# Altium project Bai 2.PrjPcb
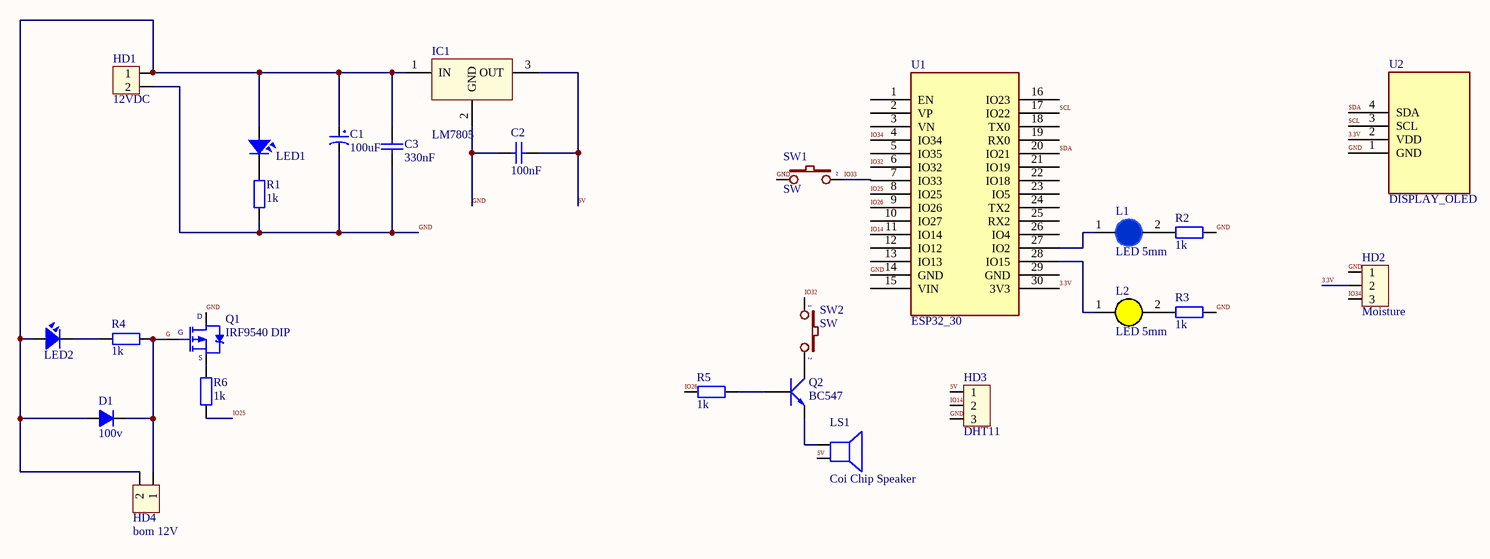
[diagram p0: Sheet1.SchDoc]
1 sheet, 26 parts. Net scope: global (net labels, ports and power ports of the same name join across sheets).
Board file: PCB1.PcbDoc

## Sheet Sheet1.SchDoc
size A2; SheetNumber: 1; SheetTotal: 1

### Parts
C1  100uF  [tu hoa 6.5mm]
C2  100nF  [tu tantalum dip5.08]
C3  330nF  [Tu tantalum dip5.08]
D1  100v  [DIODE 1A]
HD1  12VDC  [HED2]
HD2  Moisture  [HED3]
HD3  DHT11  [HED3]
HD4  bom 12V  [HED2]
IC1  LM7805  [QTO-220]
L1  LED 5mm  [LED-5MM-BLUE]
L2  LED 5mm  [LED-5MM-Yellow]
LED1  LED  [LED-3]  (value not drawn)
LED2  LED  [LED-3]  (value not drawn)
LS1  Coi Chip Speaker  [Coi Chip Speacker]
Q1  IRF9540 DIP  [TO220]
Q2  BC547  [TO92]
R1  1k  [tro vach 1w]
R2  1k  [tro vach 1w]
R3  1k  [tro vach 1w]
R4  1k  [tro vach 1w]
R5  1k  [tro vach 1w]
R6  1k  [tro vach 1w]
SW1  SW  [SW2]
SW2  SW  [SW2]
U1  ESP32_30  [ESP32_30]
U2  DISPLAY_OLED  [DISPLAY_OLED]

### Nets
3.3V: HD2.2 U1.30(3V3) U2.2(VDD)
5V: C2.1 HD3.1 IC1.3(OUT) LS1.2
G: D1.2(K) HD4.1 Q1.1(G) R4.1
GND: C1.2 C2.2 C3.2 HD1.2 HD2.1 HD3.3 IC1.2(GND) Q1.2(D) R1.1 R2.2 R3.2 SW1.1 U1.14(GND) U2.1(GND)
IO14: HD3.2 U1.11(IO14)
IO25: R6.1 U1.8(IO25)
IO26: R5.1 U1.9(IO26)
IO32: SW2.1 U1.6(IO32)
IO33: SW1.2 U1.7(IO33)
IO34: HD2.3 U1.4(IO34)
SCL: U1.17(IO22) U2.3(SCL)
SDA: U1.20(IO21) U2.4(SDA)
NetC1_1: C1.1 C3.1 D1.1(A) HD1.1 HD4.2 IC1.1(IN) LED1.1 LED2.1
NetL1_1: L1.1(A) U1.27(IO2)
NetL1_2: L1.2(K) R2.1
NetL2_1: L2.1(A) U1.28(IO15)
NetL2_2: L2.2(K) R3.1
NetLED1_2: LED1.2 R1.2
NetLED2_2: LED2.2 R4.2
NetLS1_1: LS1.1 Q2.1(E)
NetQ1_3: Q1.3(S) R6.2
NetQ2_2: Q2.2(C) SW2.2
NetQ2_3: Q2.3(B) R5.2

Not connected (* = marked no-connect by the designer): U1 1(EN) 2(VP) 3(VN) 5(IO35) 10(IO27) 12(IO12) 13(IO13) 15(VIN) 16(IO23) 18(TX0) 19(RX0) 21(IO19) 22(IO18) 23(IO5) 24(TX2) 25(RX2) 26(IO4) 29(GND)

### Library data of the parts
C1 = Tu Hoa 100uF 35V 6x8: Cắm; Don_Vi: Con; So_Chan: 2; Ten_Linh_Kien: Tụ Hóa 100uF 35V; Ma_Hang: MH006862; Chung_Loai: Cắm; Kieu_Chan: *
C2 = Tu tantalum 100nF 50V 20% DIP5.08: Cắm; Don_Vi: Con; So_Chan: 2; Ten_Linh_Kien: Tụ tantalum 104-100nF 50V 20% DIP5.08 (sứ vàng)(10PCS); Ma_Hang: MH003955; Chung_Loai: Cắm; Kieu_Chan: *
C3 = Tu tantalum 330nF 50V 20% DIP5.08: Cắm; Don_Vi: Con; So_Chan: 2; Ten_Linh_Kien: Tụ tantalum 334-330nF 50V 20% DIP5.08 (sứ vàng) (10PCS); Ma_Hang: MH003963; Chung_Loai: Cắm; Kieu_Chan: *
D1 = Diode 1N4007: Cắm; Ten_Linh_Kien: Diode 1N4007 1A (DIP); Don_Vi: Con; Ma_Hang: MH001063; Ghi Chu: *; Kieu_Chan: *; Chung_Loai: Cắm
HD1 HD4 = Hed2: Header 2 (Green); Value: Header 2
HD2 HD3 = Hed3: Header 3 (Green); Value: Header 3
IC1 = LM78xx: On ap +, from + 5 to + 24VDC; Value: LM7805
L1 = LED 5mm Xanh Duong: Cắm; Don_Vi: Con; Ma_Hang: MH008987; Ten_Linh_Kien: Led 5MM Xanh Dương Đục (1000c); Ghi_Chu: *; Kieu_Chan: *; Chung_Loai: Cắm
L2 = LED 5mm Vang: Cắm; Don_Vi: Con; Ma_Hang: MH008968; Ten_Linh_Kien: Led 5MM Phủ Vàng (1000c); Ghi_Chu: *; Kieu_Chan: *; Chung_Loai: Cắm
LED1 LED2 = LED: LED Single colour Green and Red; Value: LED 3 ly Single Colour
LS1 = Coi Chip Speaker: Còi chip
Q1 = IRF9540 DIP: P-Channel Power MOSFET; Note: Pin 2 is electrically connected to pin 4.; Published: 8-Jun-2000; LatestRevisionDate: 17-Jul-2002; LatestRevisionNote: Re-released for DXP Platform.; DatasheetVersion: PD-9.421C; PackageVersion: Feb-1997; PackageReference: TO-220AB; Publisher: Altium Limited; PackageDescription: TO, Thru-Hole, Vertical, Heatsink Mounted; 3 In-Line Leads; Pitch 2.54 mm; ComponentLink1Description: Manufacturer Link; ComponentLink1URL: http://www.irf.com/; ComponentLink2Description: Datasheet; ComponentLink2URL: http://www.irf.com/product-info/datasheets/data/irf9540.pdf
Q2 = C1815: NPN transistor; Value: C9014
R1-R6 = Tro Vach 1W 5% 1k: Cắm; Don_Vi: Con; So_Chan: 2; Ten_Linh_Kien: Trở 5% 1w 1k; Ma_Hang: MH006397; Chung_Loai: Cắm; Kieu_Chan: *
SW1 SW2 = SW2: Switch button 2 pin; Value: SW chip 2 pin
U1 = ESP32_30: Microcontoller Board 30 Pins Wifi 2.4GHz BLE 4.2 ESP32-WROOM-32D; ComponentLink1Description: Datasheet; ComponentLink1URL: https://www.mouser.com/datasheet/2/891/esp32_wroom_32d_esp32_wroom_32u_datasheet_en-1365844.pdf
U2 = DISPLAY_OLED: Display Oled 128x64 0.96" I2C.